# EAGLE design CurrentStabilizer (EAGLE 6.1)
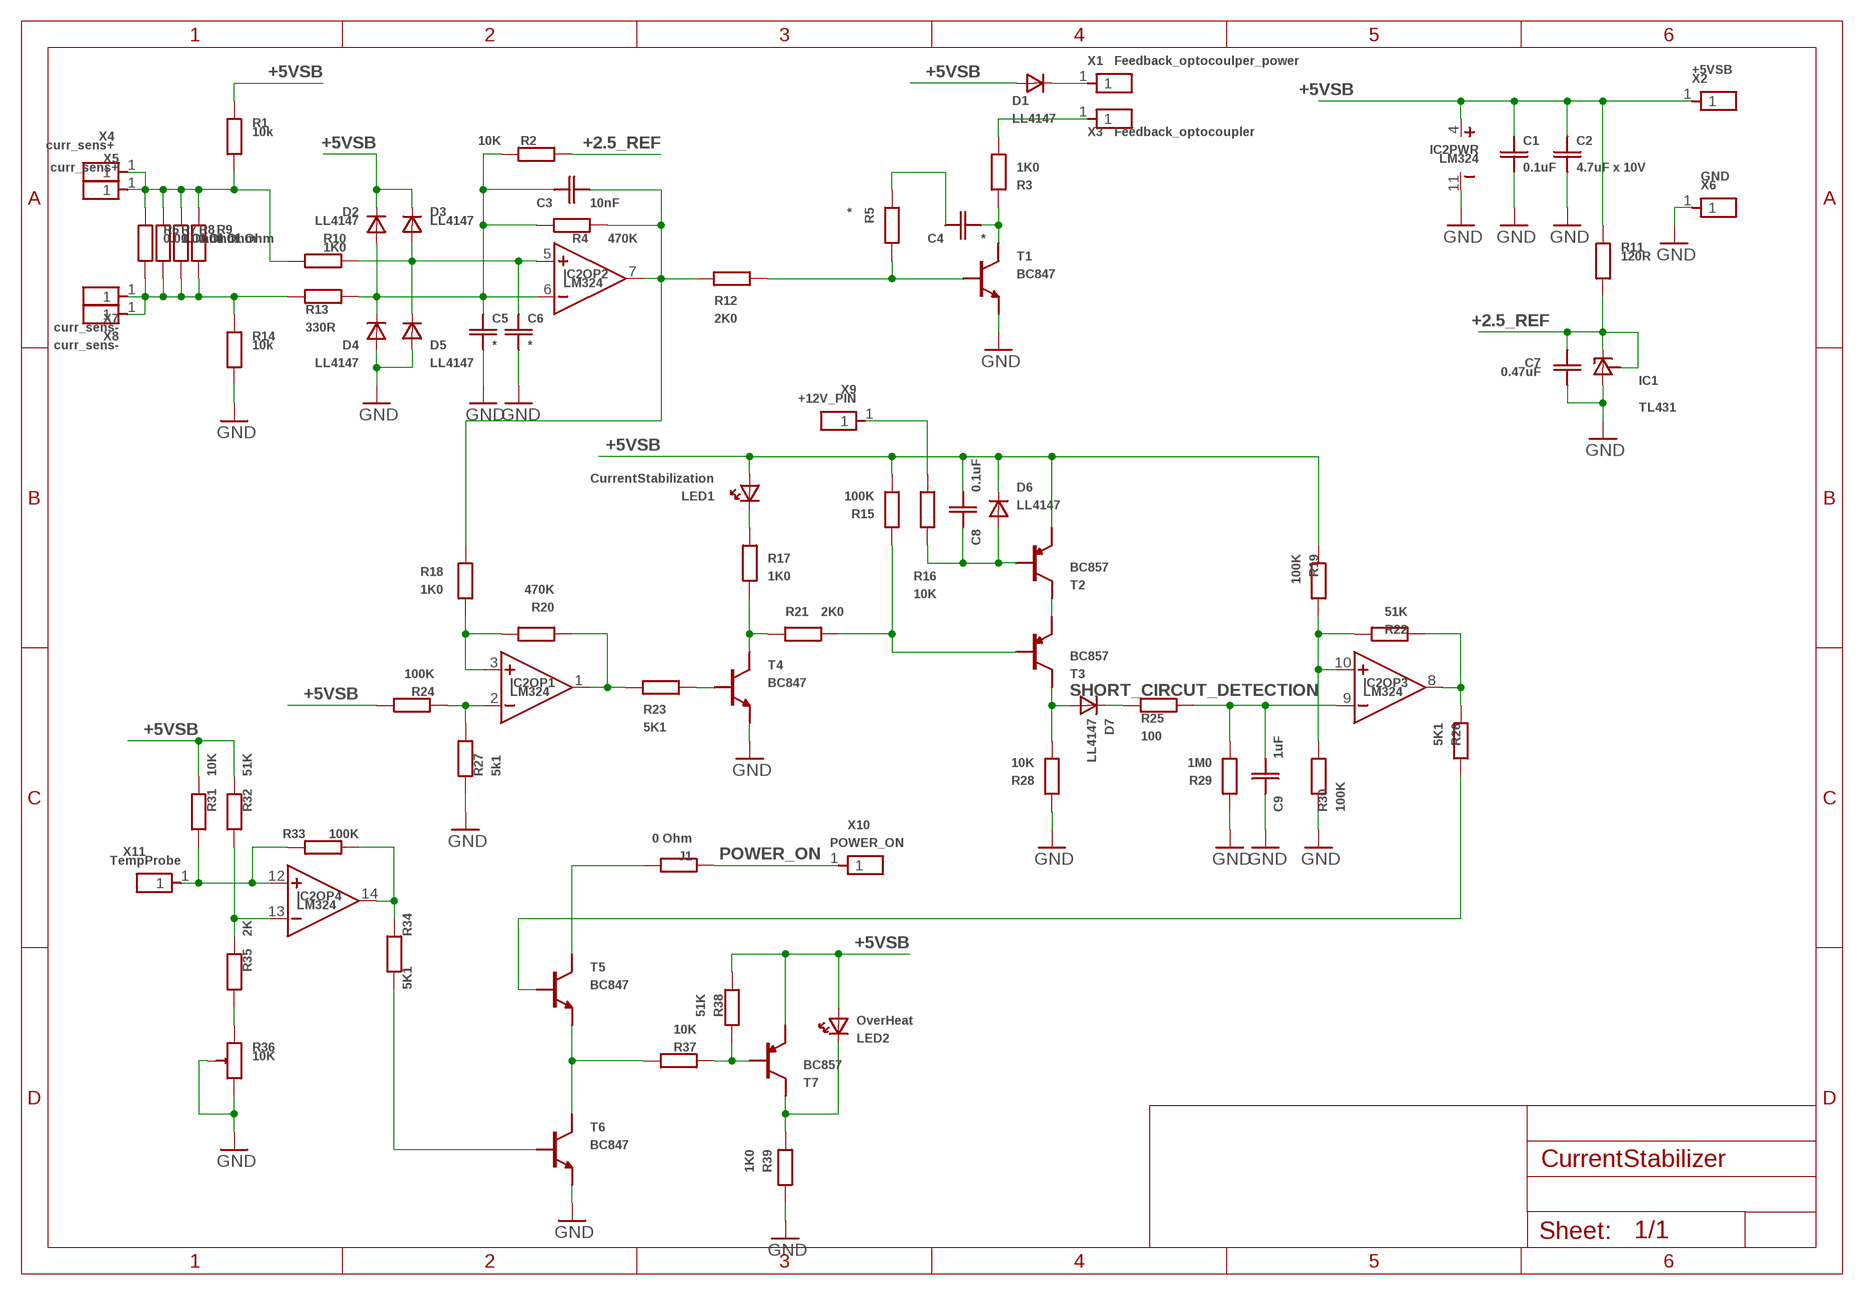
[diagram p0: schematic, sheet 1]

## Parts
C1  0.1uF  CSMD_1206_BIG_GAP  [RSMD_1206_BIG_GAP]
C2  4.7uF x 10V  CSMD_1206  [RSMD_1206]
C3  10nF  CSMD_0805  [RSMD_0805]
C4  *  CSMD_0805  [RSMD_0805]
C5  *  CSMD_0805  [RSMD_0805]
C6  *  CSMD_0805  [RSMD_0805]
C7  0.47uF  CSMD_0805  [RSMD_0805]
C8  0.1uF  CSMD_0805  [RSMD_0805]
C9  1uF  CSMD_0805  [RSMD_0805]
D1  LL4147  LL4147SOD-80  [SOD-80]
D2  LL4147  LL4147SOD-80  [SOD-80]
D3  LL4147  LL4147SOD-80  [SOD-80]
D4  LL4147  LL4147SOD-80  [SOD-80]
D5  LL4147  LL4147SOD-80  [SOD-80]
D6  LL4147  LL4147SOD-80  [SOD-80]
D7  LL4147  LL4147SOD-80  [SOD-80]
IC1  TL431  TL431SOT23  [SOT23]
IC2  LM324  [SOIC14]
J1  0 Ohm  RSMD_0805  [RSMD_0805]
LED1  CurrentStabilization  LED3MM  [LED3MM]
LED2  OverHeat  LED3MM  [LED3MM]
R1  10k  RSMD_0805  [RSMD_0805]
R2  10K  RSMD_0805  [RSMD_0805]
R3  1K0  RSMD_0805  [RSMD_0805]
R4  470K  RSMD_0805  [RSMD_0805]
R5  *  RSMD_0805  [RSMD_0805]
R6  0.01 Ohm  RSMD_2512  [RSMD_2512]
R7  0.01 Ohm  RSMD_2512  [RSMD_2512]
R8  0.01 Ohm  RSMD_2512  [RSMD_2512]
R9  0.01 Ohm  RSMD_2512  [RSMD_2512]
R10  1K0  RSMD_0805  [RSMD_0805]
R11  120R  RSMD_0805  [RSMD_0805]
R12  2K0  RSMD_0805  [RSMD_0805]
R13  330R  RSMD_0805  [RSMD_0805]
R14  10k  RSMD_0805  [RSMD_0805]
R15  100K  RSMD_0805  [RSMD_0805]
R16  10K  RSMD_0805  [RSMD_0805]
R17  1K0  RSMD_0805  [RSMD_0805]
R18  1K0  RSMD_0805  [RSMD_0805]
R19  100K  RSMD_0805  [RSMD_0805]
R20  470K  RSMD_0805  [RSMD_0805]
R21  2K0  RSMD_0805  [RSMD_0805]
R22  51K  RSMD_0805  [RSMD_0805]
R23  5K1  RSMD_0805  [RSMD_0805]
R24  100K  RSMD_0805  [RSMD_0805]
R25  100  RSMD_0805  [RSMD_0805]
R26  5K1  RSMD_0805  [RSMD_0805]
R27  5k1  RSMD_0805  [RSMD_0805]
R28  10K  RSMD_0805  [RSMD_0805]
R29  1M0  RSMD_0805  [RSMD_0805]
R30  100K  RSMD_0805  [RSMD_0805]
R31  10K  RSMD_0805  [RSMD_0805]
R32  51K  RSMD_0805  [RSMD_0805]
R33  100K  RSMD_0805  [RSMD_0805]
R34  5K1  RSMD_0805  [RSMD_0805]
R35  2K  RSMD_0805  [RSMD_0805]
R36  10K  R_ADJSTAND_6.5_X_3.5MM  [R_ADJ_STAND]
R37  10K  RSMD_0805  [RSMD_0805]
R38  51K  RSMD_0805  [RSMD_0805]
R39  1K0  RSMD_1206  [RSMD_1206]
T1  BC847  BC847SOT23_SMALL_PADS  [SOT23_SMALL_PADS]
T2  BC857  BC857SOT23_SMALL_PADS  [SOT23_SMALL_PADS]
T3  BC857  BC857SOT23_SMALL_PADS  [SOT23_SMALL_PADS]
T4  BC847  BC847SOT23_SMALL_PADS  [SOT23_SMALL_PADS]
T5  BC847  BC847SOT23_SMALL_PADS  [SOT23_SMALL_PADS]
T6  BC847  BC847SOT23_SMALL_PADS  [SOT23_SMALL_PADS]
T7  BC857  BC857SOT23_SMALL_PADS  [SOT23_SMALL_PADS]
X1  Feedback_optocoulper_power  PIN1X12.54MM  [PIN1X1_2.54MM]
X2  +5VSB  PIN1X12.54MM  [PIN1X1_2.54MM]
X3  Feedback_optocoupler  PIN1X12.54MM  [PIN1X1_2.54MM]
X4  curr_sens+  PIN1X12.54MM  [PIN1X1_2.54MM]
X5  curr_sens+  PIN1X12.54MM  [PIN1X1_2.54MM]
X6  GND  PIN1X12.54MM  [PIN1X1_2.54MM]
X7  curr_sens-  PIN1X12.54MM  [PIN1X1_2.54MM]
X8  curr_sens-  PIN1X12.54MM  [PIN1X1_2.54MM]
X9  +12V_PIN  PIN1X12.54MM  [PIN1X1_2.54MM]
X10  POWER_ON  PIN1X12.54MM  [PIN1X1_2.54MM]
X11  TempProbe  PIN1X12.54MM  [PIN1X1_2.54MM]

## Nets
+2.5_REF: C7.PAD_1(PIN1) IC1.1(CATHODE) IC1.2(REFERENCE) R2.PAD_0(PIN0) R11.PAD_0(PIN0)
+5VSB: C1.PAD_1(PIN1) C2.PAD_1(PIN1) C8.PAD_0(PIN0) D1.ANODE D2.CATHODE D3.CATHODE D6.CATHODE IC2.4(PWR:VCC) LED1.ANODE LED2.ANODE R1.PAD_1(PIN1) R11.PAD_1(PIN1) R15.PAD_0(PIN0) R19.PAD_0(PIN0) R24.PAD_1(PIN1) R31.PAD_1(PIN1) R32.PAD_1(PIN1) R38.PAD_0(PIN0) T2.2(E) T7.2(E) X2.1
GND: C1.PAD_0(PIN0) C2.PAD_0(PIN0) C5.PAD_0(PIN0) C6.PAD_0(PIN0) C7.PAD_0(PIN0) C9.PAD_1(PIN1) D4.ANODE D5.ANODE IC1.3(ANODE) IC2.11(PWR:GND) R14.PAD_0(PIN0) R27.PAD_0(PIN0) R28.PAD_1(PIN1) R29.PAD_1(PIN1) R30.PAD_0(PIN0) R36.2(ADJ) R36.3(END_B) R39.PAD_1(PIN1) T1.2(E) T4.2(E) T6.2(E) X6.1
N$1: R1.PAD_0(PIN0) R6.PAD1(PIN1) R7.PAD1(PIN1) R8.PAD1(PIN1) R9.PAD1(PIN1) R10.PAD_0(PIN0) X4.1 X5.1
N$2: R6.PAD0(PIN0) R7.PAD0(PIN0) R8.PAD0(PIN0) R9.PAD0(PIN0) R13.PAD_0(PIN0) R14.PAD_1(PIN1) X7.1 X8.1
N$3: C6.PAD_1(PIN1) D3.ANODE D5.CATHODE IC2.5(OP2:IN+) R10.PAD_1(PIN1)
N$4: C3.PAD_1(PIN1) C5.PAD_1(PIN1) D2.ANODE D4.CATHODE IC2.6(OP2:IN-) R2.PAD_1(PIN1) R4.PAD_0(PIN0) R13.PAD_1(PIN1)
N$5: IC2.3(OP1:IN+) R18.PAD_0(PIN0) R20.PAD_0(PIN0)
N$6: IC2.12(OP4:IN+) R31.PAD_0(PIN0) R33.PAD_1(PIN1) X11.1
N$7: C4.PAD_1(PIN1) R5.PAD_1(PIN1)
N$8: R23.PAD_0(PIN0) T4.1(B)
N$9: R3.PAD_1(PIN1) X3.1
N$10: C4.PAD_0(PIN0) R3.PAD_0(PIN0) T1.3(C)
N$11: IC2.1(OP1:OUT) R20.PAD_1(PIN1) R23.PAD_1(PIN1)
N$12: R17.PAD_1(PIN1) R21.PAD_0(PIN0) T4.3(C)
N$13: R37.PAD_0(PIN0) R38.PAD_1(PIN1) T7.1(B)
N$14: LED1.CATHODE R17.PAD_0(PIN0)
N$15: IC2.13(OP4:IN-) R32.PAD_0(PIN0) R35.PAD_1(PIN1)
N$16: IC2.14(OP4:OUT) R33.PAD_0(PIN0) R34.PAD_1(PIN1)
N$17: R34.PAD_0(PIN0) T6.1(B)
N$18: R5.PAD_0(PIN0) R12.PAD_0(PIN0) T1.1(B)
N$19: C8.PAD_1(PIN1) D6.ANODE R16.PAD_1(PIN1) T2.1(B)
N$20: R16.PAD_0(PIN0) X9.1
N$21: T2.3(C) T3.2(E)
N$22: R15.PAD_1(PIN1) R21.PAD_1(PIN1) T3.1(B)
N$23: D7.CATHODE R25.PAD_0(PIN0)
N$24: C9.PAD_0(PIN0) IC2.9(OP3:IN-) R25.PAD_1(PIN1) R29.PAD_0(PIN0)
N$25: IC2.10(OP3:IN+) R19.PAD_1(PIN1) R22.PAD_1(PIN1) R30.PAD_1(PIN1)
N$26: IC2.8(OP3:OUT) R22.PAD_0(PIN0) R26.PAD_0(PIN0)
N$27: R26.PAD_1(PIN1) T5.1(B)
N$28: R37.PAD_1(PIN1) T5.2(E) T6.3(C)
N$29: IC2.2(OP1:IN-) R24.PAD_0(PIN0) R27.PAD_1(PIN1)
N$30: C3.PAD_0(PIN0) IC2.7(OP2:OUT) R4.PAD_1(PIN1) R12.PAD_1(PIN1) R18.PAD_1(PIN1)
N$31: D1.CATHODE X1.1
N$32: R35.PAD_0(PIN0) R36.1(END_A)
N$33: J1.PAD_1(PIN1) T5.3(C)
N$34: LED2.CATHODE R39.PAD_0(PIN0) T7.3(C)
POWER_ON: J1.PAD_0(PIN0) X10.1
SHORT_CIRCUT_DETECTION: D7.ANODE R28.PAD_0(PIN0) T3.3(C)

## Library data of the parts
C1-C9 = __MyCommonLib1:C
D1-D7 = __MyCommonLib1:LL4147
IC1 = __MyCommonLib1:TL431
IC2 = __MyCommonLib1:LM324
J1 R1-R35 R37-R39 = __MyCommonLib1:R
LED1 LED2 = __MyCommonLib1:LED3MM
R36 = __MyCommonLib1:R_ADJ
T1 T4-T6 = __MyCommonLib1:BC847
T2 T3 T7 = __MyCommonLib1:BC857
X1-X11 = __MyCommonLib1:PIN1X1

## Board
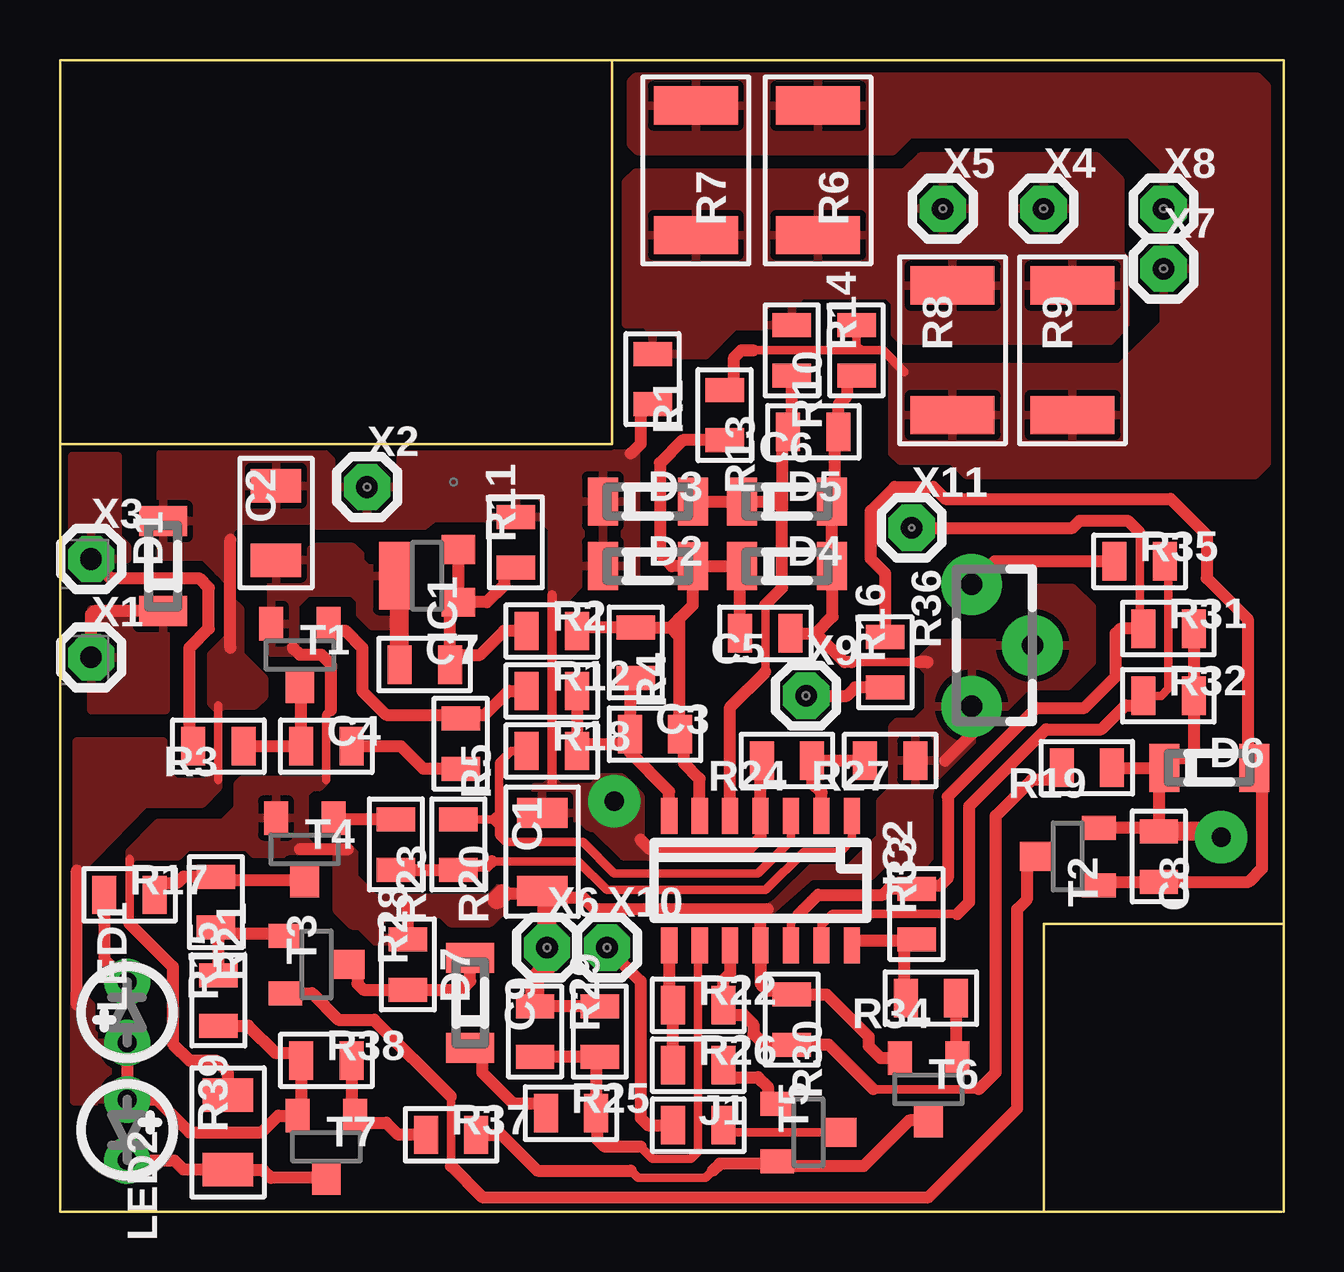
[diagram p1: board, top side]
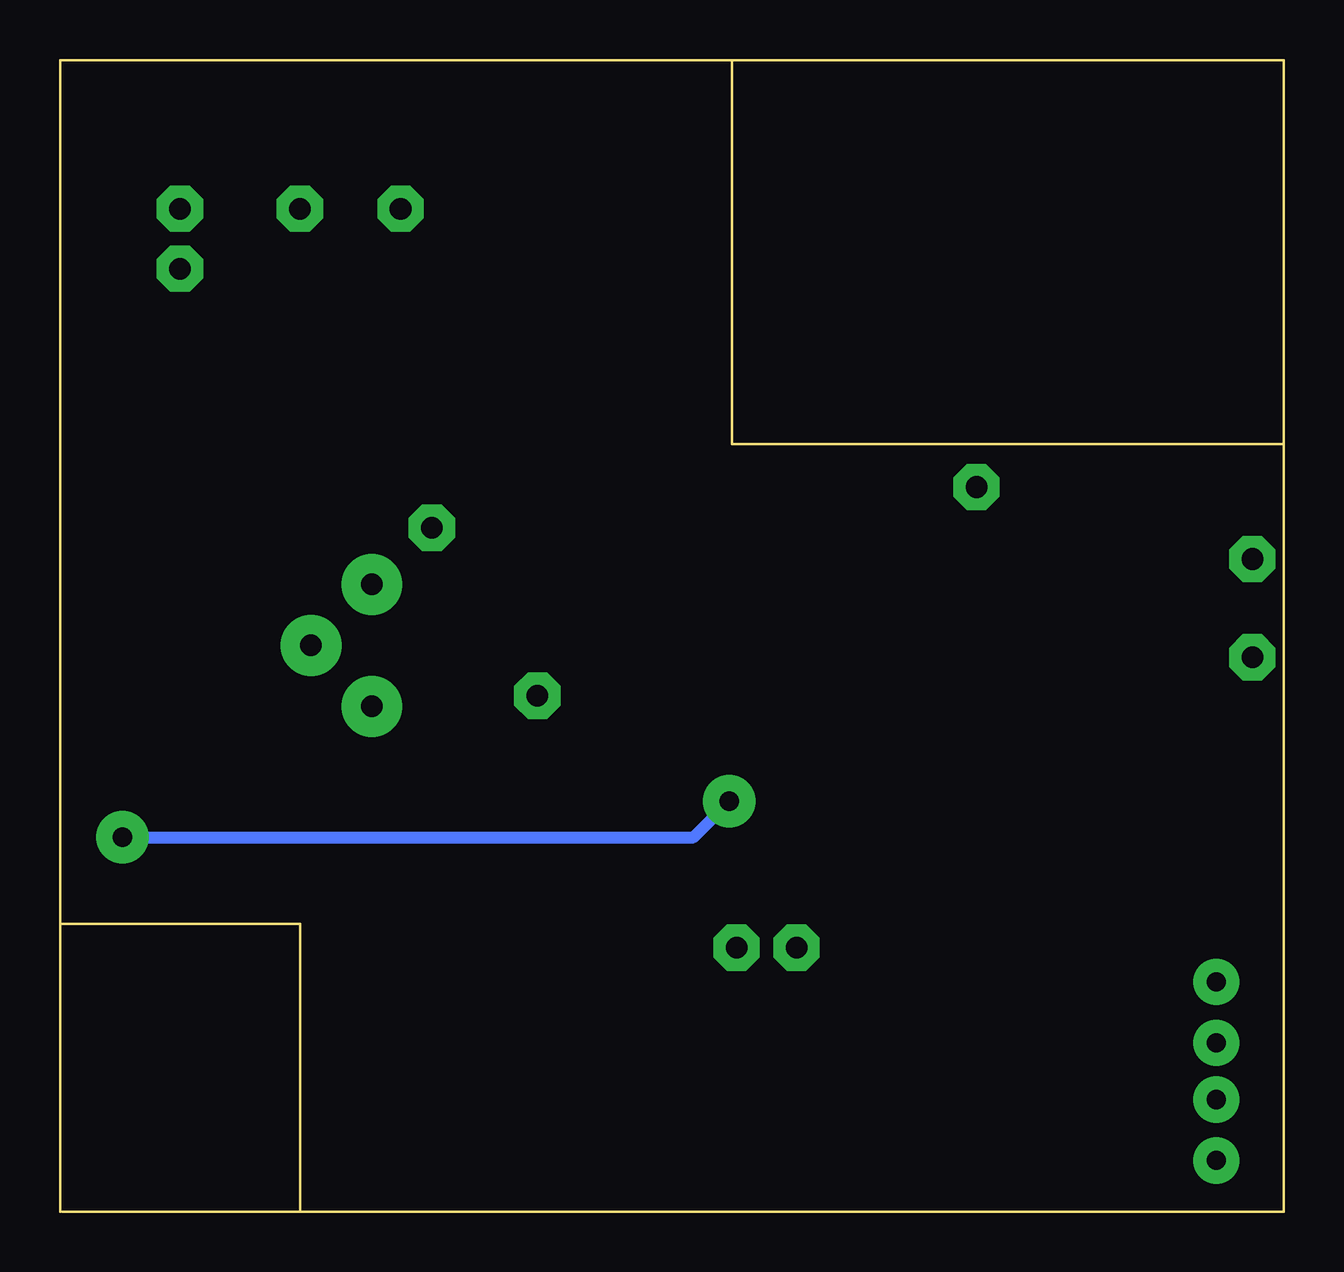
[diagram p2: board, bottom side, seen from below]

Size 51 x 48 mm. Coordinates in mm from the lower left corner, seen from the top.
Outline: 51,12 51,48 23,48
Outline: 41,0 0,0 0,32
Outline: 0,32 23,32 23,48
Outline: 41,0 41,12 51,12
Outline: 51,0 51,12
Outline: 41,0 50.9,0
Outline: 23,48 0,48 0,32
Copper layers (1*16): Top 0.035mm / dielectric 1.5mm / Bottom 0.035mm
Design rules: minimum track width 0.35mm, minimum drill 0.6mm, track to track 0.35mm, track to pad 0.35mm, pad to pad 0.35mm, via to via 0.35mm, smd to smd 0mil, copper to edge 0.2mm, drill to drill 1mm, minimum pad ring 0.35mm, minimum via ring 0.35mm, stop-mask expansion 0mil, vias tented up to drill 0mil, thermal gap 10mil

### Footprints (pad centres in the part's own frame; a part is rotated, then mirrored left to right if it is on the bottom)
RSMD_1206_BIG_GAP = smd 1.25 x 2.1: PAD_0 -1.625,0; PAD_1 1.625,0
RSMD_1206 = smd 1.4 x 2.1: PAD_0 -1.55,0; PAD_1 1.55,0
RSMD_0805 = smd 1 x 1.6: PAD_0 -1.05,0; PAD_1 1.05,0
SOD-80 = smd 1.25 x 2: ANODE 1.875,0; CATHODE -1.875,0
SOT23 = smd 1.2 x 1.4: 1 1.1,1.3; 2 -1.1,1.3 | smd 2.8 x 1.4: 3 0,-1.3
SOIC14 = smd 1.5 x 0.68: 1 -2.699,3.81; 2 -2.699,2.54; 3 -2.699,1.27; 4 -2.699,0; 5 -2.699,-1.27; 6 -2.699,-2.54; 7 -2.699,-3.81; 8 2.699,-3.81; 9 2.699,-2.54; 10 2.699,-1.27; 11 2.699,0; 12 2.699,1.27; 13 2.699,2.54; 14 2.699,3.81
LED3MM = drill 0.8 pad 1.93: ANODE -1.27,0; CATHODE 1.27,0
RSMD_2512 = smd 1.6 x 3.5: PAD0 -2.7,0; PAD1 2.7,0
R_ADJ_STAND = drill 0.9 pad 2.54: 1 -2.54,0; 2 0,2.54; 3 2.54,0
SOT23_SMALL_PADS = smd 1 x 1.4: 1 1.2,1.3; 2 -1.2,1.3 | smd 1.2 x 1.4: 3 0,-1.3
PIN1X1_2.54MM = drill 0.9 pad 1.93 octagon: 1 0,0

### Placement (x,y rotation side)
C1  20.1,15 90 top
C2  9,28.7 90 top
C3  24.8,19.9 0 top
C4  11.1,19.4 0 top
C5  29.4,24.1 180 top
C6  31.4,32.5 180 top
C7  15.2,22.8 0 top
C8  45.8,14.8 270 top
C9  19.8,7.5 90 top
D1  4.3,26.9 90 top
D2  24.5,26.9 0 top
D3  24.5,29.6 0 top
D4  30.3,26.9 0 top
D5  30.3,29.6 0 top
D6  47.9,18.5 0 top
D7  17.1,8.7 90 top
IC1  15.3,26.5 270 top
IC2  29.2,13.8 270 top
J1  26.6,3.6 0 top
LED1  2.8,8.3 90 top
LED2  2.8,3.4 270 top
R1  24.7,34.7 270 top
R2  20.5,24.2 0 top
R3  6.6,19.4 180 top
R4  24,23.3 270 top
R5  16.7,19.5 270 top
R6  31.6,43.4 270 top
R7  26.5,43.4 270 top
R8  37.2,35.9 90 top
R9  42.2,35.9 90 top
R10  30.5,35.9 270 top
R11  19,27.9 90 top
R12  20.5,21.7 0 top
R13  27.7,33.2 270 top
R14  33.2,35.9 90 top
R15  6.6,8.8 90 top
R16  34.4,22.9 90 top
R17  2.9,13.2 0 top
R18  20.5,19.2 0 top
R19  42.8,18.5 180 top
R20  16.6,15.3 270 top
R21  6.5,12.9 270 top
R22  26.6,8.6 0 top
R23  14,15.3 270 top
R24  30.3,18.8 180 top
R25  21.3,4.1 0 top
R26  26.6,6.1 0 top
R27  34.6,18.8 180 top
R28  14.5,10.3 90 top
R29  22.5,7.5 90 top
R30  30.5,8 270 top
R31  46.2,24.3 0 top
R32  46.2,21.5 0 top
R33  35.7,12.4 90 top
R34  36.3,8.9 180 top
R35  45,27.1 0 top
R36  38,23.6 270 top
R37  16.3,3.2 0 top
R38  11.1,6.3 0 top
R39  7,3.3 90 top
T1  10,23.2 0 top
T2  42,14.8 270 top
T3  10.7,10.3 90 top
T4  10.2,15.1 0 top
T5  31.2,3.3 90 top
T6  36.2,5.1 0 top
T7  11.1,2.7 0 top
X1  1.3,23.1 0 top
X2  12.8,30.2 0 top
X3  1.3,27.2 0 top
X4  41,41.8 0 top
X5  36.8,41.8 0 top
X6  20.3,11 0 top
X7  46,39.3 0 top
X8  46,41.8 0 top
X9  31.1,21.5 0 top
X10  22.8,11 0 top
X11  35.5,28.5 0 top

### Tracks (layer width: path | path; a pad name or v marks a point on that pad's centre or on a via)
+2.5_REF
  Top 0.5: IC1.2 IC1.1 | IC1.1 16.25,25.05 C7.PAD_1 16.65,23.2 17.5,23.2 18.5,24.2 R2.PAD_0 | R11.PAD_0 18.5,26.85 18.5,26.1 17.8,25.4 IC1.1
+5VSB  (via drill 0.8 pad 2.18)
  Top 0.35: 6.6,18 6.6,21.1
  Top 0.4: 20.5,17.8 20.5,25.7
  Top 0.5: LED1.ANODE LED2.ANODE 4.03,4.67 5.4,3.3 8.4,3.3 9.1,4 T7.2 10.05,4.15 R38.PAD_0 9.75,6.6 9,6.6 7.85,7.75 R15.PAD_0 | 0.7,8.63 0.7,14.2 | 7.1,23.5 7.1,28 | R19.PAD_0 D6.CATHODE | R31.PAD_1 R32.PAD_1 47.25,19.15 47,18.9 46.02,18.9 D6.CATHODE | 24.2,15.5 24.6,15.1 28.7,15.1 29.2,15.6 IC2.4 29.2,18.75 R24.PAD_1 | D6.CATHODE 45.8,18.27 C8.PAD_0 45.65,16 T2.2 | R1.PAD_1 24.2,33.65 24.2,32 23.8,31.6
  Top 0.8: v48.4,15.6 48.15,15.85 C8.PAD_0
  Bottom 0.5: v48.4,15.6 24.6,15.6 v23.1,17.1
  pour Top: 4.2,31.6 4.2,27.3 6,27.3 7.1,26.2 7.1,28.4 7.5,28.8 10.5,28.8 10.7,28.6 15.2,28.6 15.6,28.9 20.1,28.9 20.5,28.5 20.5,25.5 21,25.5 21.8,26.3 24,26.3 24,31.6 14.4,31.6 14.2,31.4 14.2,30.4 14,30.2 11.4,30.2 11.3,30.3 11.3,31.3 11,31.6
  pour Top: 19.8,16.4 21.7,16.4 22.1,16 22.3,16 23.5,14.8 28.5,14.8 28.7,15 28.7,15.2 24.6,15.2 24.2,15.6 24.2,17.3 23.4,18.1 22.6,18.1 22.2,17.7 20.8,17.7 20.5,18 20.2,17.7 19.8,17.7
  pour Top: 6.6,20.9 6.3,21.2 6.3,22.9 6.3,23.2 7.1,24 7.1,25.5 7.5,25.1 7.5,23.2 8,22.7 8.5,22.2 8.5,21.5 8.1,21.1 7.2,21.1 6.8,21.1
  pour Top: 0.7,14.1 3.5,17 5.9,17 6.6,17.7 6.6,18.4 6.1,17.9 4.8,17.9 4.3,18.4 4.3,19.6 0.7,19.6
  pour Top: 2.8,4.6 0.6,4.6 0.6,9.1 0.8,9.1 1.3,8.6 1.3,7.5 1.6,7.2 2.9,7.2
GND
  Top 0.35: 2.9,12 2.9,14.7 | 35.8,22.9 33,22.9 | 11.3,20.9 11.1,20.7 11.1,18
  Top 0.5: 12,15.1 10,15.1 | 2.9,12 4.7,10.2 4.7,7 5.4,6.3 6.5,6.3 7,5.8 R39.PAD_1 | 37.96,21.1 R36.3 38,19.9 36.9,18.8 | C5.PAD_0 31.5,24.1 | 31.5,24.1 32.2,24.8 32.2,26.88 D4.ANODE D5.ANODE 32.3,29.73 32.3,32.35 C6.PAD_0 32.45,33.65 32.8,34 32.8,34.45 R14.PAD_0 | 36.16,22.9 35.8,22.9 | 33,22.9 32.7,22.9 31.5,24.1 | R27.PAD_0 35.6,18.75 | T6.2 34.2,6.4 33.7,6.9 33.7,7.3 31.95,9.05 R30.PAD_0 30.35,9.2 29.5,9.2 29.2,9.5 IC2.11 29.2,12.3 29.5,12.6 22.3,12.6 21.8,13.1 20.38,13.1 C1.PAD_0 19.98,13.25 18.45,13.25 | R29.PAD_1 C9.PAD_1 | R28.PAD_1 14.5,12.7 | 11.3,20.9 11.3,22.8 10.9,23.2 10,23.2 9.7,23.5
  Top 0.8: C7.PAD_0 14.15,26.35 IC1.3 | C9.PAD_1 19.8,9.7 20.3,10.2 X6.1 20.3,13.38 C1.PAD_0 | 18.45,13.25 18.2,13
  pour Top: 29.1,12.1 29.2,12.1 29.6,12.5 31.3,14 33.8,14 34.3,14.5 36,14.5 36.3,14.8 36.3,17.9 40.3,21.9 42,21.9 43,22.9 43,25.2 42.2,26 40.5,26 40.5,23.7 36.6,23.7 35.8,22.9 36.2,22.5 36.2,20.9 35.7,20.4 34.9,20.4 34.7,20.2 34.7,17.6 34.2,17.1 34.2,15.6 32.9,14.3 31.2,14.3 29.5,12.6 28.6,12.6
  pour Top: 11.6,15.1 11.6,12.6 12.2,12 12.5,12 13.2,11.3 14.4,11.3 14.4,12 14.9,12.5 15.9,12.5 16.3,12.1 17.9,12.1 18.4,12.6 18.4,13.5 17.9,13 13.1,13 12.2,13.9 12.2,14.9 12,15.1
  pour Top: 2.9,14.6 3.1,14.8 4.9,14.8 5.3,15.2 7.8,15.2 8.1,14.9 10.5,14.9 10.6,15.1 10.2,15.5 10.2,17.4 10.5,17.7 10.8,17.7 11.1,18 7.6,18 7.4,17.8 7.4,16.8 6.8,16.2 4.1,16.2 2.9,15
  pour Top: 8.8,23.3 9.8,23.3 9.8,25.3 10.3,25.8 12.2,25.8 12.5,25.5 12.5,24.9 13,24.4 14.2,24.4 14.2,26.8 12.8,26.8 12.5,27.1 12.5,27.4 12.2,27.7 10.6,27.7 10.1,27.2 8.8,27.2
N$1
  pour Top: 23.6,37 24.4,37 24.6,36.8 24.6,35.9 24.8,35.7 26.9,35.7 28.1,36.9 30.5,36.9 30.5,37.8 30.9,38.2 34.5,38.2 34.8,37.9 34.8,36.6 35.1,36.3 43.8,36.3 44.4,37 44.4,39.7 44.2,39.9 44.2,43 43.2,44 35.9,44 35.2,43.3 24,43.3 23.6,42.9
N$2
  Top 0.35: 28.9,35.9 33,35.9 | 33,35.9 33.2,36.1 | R14.PAD_1 33.2,36.1 | 33.2,36.1 33.4,35.9 | 33.4,35.9 33,35.9 | 33.4,35.9 34.3,35.9 35.2,35
  Top 0.5: R13.PAD_0 28.1,34.25 28.1,35.6 28.4,35.9 28.9,35.9
  pour Top: 44.2,35.2 35,35.2 34.7,35.5 34.7,31.6 35,31.3 37.2,31.3 37.8,30.7 49.8,30.7 50.3,31.2 50.3,46.9 49.9,47.3 24,47.3 23.8,47.1 23.8,44.5 24.1,44.2 34.7,44.2 35.4,44.9 44.6,44.9 46,43.5 46,37
N$3
  Top 0.35: 29.4,22.5 29.4,25.3
  Top 0.5: 29.4,25.3 30.1,26 30.1,29.3 | D3.ANODE D5.CATHODE 29.8,29.6 | IC2.5 27.93,21.03 29.4,22.5 | 30.1,29.3 29.8,29.6 | 29.8,29.6 30.1,29.9 | 30.1,29.9 30.1,29.3 | 30.1,29.9 30.1,32.25 C6.PAD_1 30.5,32.65 R10.PAD_1
N$4
  Top 0.5: D2.ANODE D4.CATHODE 28.35,26.82 C5.PAD_1 | D2.ANODE 26.38,25.27 25.8,24.7 | D2.ANODE 25.5,26.9 25,27.4 25,31.2 25.95,32.15 R13.PAD_1 | IC2.6 26.66,18.04 26,18.7 26,19.75 C3.PAD_1 25.8,19.95 25.8,24 | R2.PAD_1 21.55,24.35 R4.PAD_0 25.45,24.35 25.8,24.7 | 25.8,24 25.5,24.3 | 25.8,24.7 25.8,24
N$5
  Top 0.35: IC2.3 30.47,15.47 29.1,14.1 23.1,14.1 21.8,15.4 18.6,15.4 18.3,15.7 18.3,16.1 | 18.3,16.1 18.3,16.6 | R20.PAD_0 18.05,16.35 18.3,16.1 | 18.3,16.6 18.1,16.4 | R18.PAD_0 18.8,19.2 18.3,18.7 18.3,16.6
N$6
  Top 0.35: 45,28.3 45,24.5 | IC2.12 30.47,12.07 30.8,12.4
  Top 0.5: X11.1 42.2,28.5 42.5,28.8 44.5,28.8 45,28.3 | 45,24.5 45,24.45 R31.PAD_0 44.2,24.3 44,24.1 44,22.3 42.7,21 40.7,21 37,17.3 37,13.9 36.7,13.6 35.85,13.6 R33.PAD_1 34.55,13.45 34.3,13.2 31.6,13.2 30.8,12.4
N$7
  Top 0.5: C4.PAD_1 14.2,19.4 15.15,18.45 R5.PAD_1
N$8
  Top 0.5: R23.PAD_0 11.45,16.35 T4.1
N$9
  Top 0.5: X3.1 2.1,26.4 5.8,26.4 6.2,26 6.2,24.3 5.4,23.5 5.4,19.55 R3.PAD_1
  pour Top: 1.4,27.2 2.8,27.2 2.8,27.7 2.4,28.1 2.4,31.5 0.5,31.5 0.5,27.2
N$10
  Top 0.5: T1.3 10.05,21.85 C4.PAD_0 R3.PAD_0
N$11
  Top 0.35: IC2.1 33.01,15.51 32.5,15 31,15 29.4,13.4 22.8,13.4 21.6,14.6 18,14.6
  Top 0.5: R23.PAD_1 R20.PAD_1 16.7,14.35 16.7,14.4 17.8,14.4 18,14.6
N$12
  Top 0.5: T4.3 6.65,13.8 R21.PAD_0 5.15,13.95 4.9,13.7 3.95,13.7 R17.PAD_1
N$13
  Top 0.5: R38.PAD_1 12.15,4.15 T7.1 12.3,3.7 13.6,3.7 14.1,3.2 R37.PAD_0
N$14
  Top 0.5: R17.PAD_0 1.85,10.52 LED1.CATHODE
N$15
  Top 0.35: 37.4,12.4 32.2,12.4 31.74,11.94 IC2.13 | R35.PAD_1 46.2,26.95 46.2,21.8 45.9,21.5 R32.PAD_0
  Top 0.5: 37.4,12.4 37.9,12.9 37.9,16.9 41.1,20.1 43.4,20.1 44.4,21.1 45.1,21.1 45.1,21.45 R32.PAD_0
N$16
  Top 0.5: IC2.14 33.21,11.3 35.2,11.3 | 35.2,11.3 35.65,11.3 R33.PAD_0 | R34.PAD_1 35.2,8.95 35.2,11.3
N$17
  Top 0.5: R34.PAD_0 37.35,6.45 T6.1
N$18
  Top 0.5: R12.PAD_0 18.7,21.7 17.7,20.7 16.85,20.7 R5.PAD_0 16.6,20.65 16.6,20.7 13.6,20.7 12.6,21.7 12.6,23.5 11.9,24.2 11.5,24.2 T1.1
N$19
  Top 0.5: R16.PAD_1 34.4,26.6 33.8,27.2 33.8,29.2 34.8,30.2 36.4,30.2 36.9,29.7 46.3,29.7 47.8,28.2 47.8,26.4 49.5,24.7 49.5,18.8 49.8,18.5 D6.ANODE 50.1,18.18 50.1,14.3 49.55,13.75 C8.PAD_1 43.45,13.75 T2.1
N$20
  Top 0.5: X9.1 32.8,21.5 33.15,21.85 R16.PAD_0
N$21
  Top 0.35: 16.3,4.8 16.3,1.9
  Top 0.5: 16.3,4.8 13.1,8 11.6,8 10.5,9.1 T3.2 | 16.3,1.9 17.6,0.6 36.2,0.6 39.9,4.3 39.9,12.6 40.3,13 40.3,14.4 T2.3
N$22
  Top 0.5: R21.PAD_1 6.6,11.75 | 6.6,11.75 R15.PAD_1 | 6.6,11.75 6.75,11.6 9.3,11.6 T3.1
N$23
  Top 0.5: D7.CATHODE 17.6,6.33 17.6,5.8 18.9,4.5 19.85,4.5 R25.PAD_0
N$24
  Top 0.35: IC2.9 26.6,11.04 26.6,2.5 26.3,2.2 24.7,2.2 24.2,2.7
  Top 0.5: C9.PAD_0 R29.PAD_0 22.35,6.3 R25.PAD_1 22.4,4.1 | 24.2,2.7 22.7,2.7 22.4,3 22.4,4.1 | 22.4,4.1 22.3,4.2
N$25
  Top 0.35: 38.3,5.1 33.9,5.1
  Top 0.5: 38.3,5.1 39,5.8 39,16.5 40.5,18 41.5,18 41.5,18.25 arc-90 R19.PAD_1 | IC2.10 27.93,9.93 27.65,9.65 R22.PAD_1 28.05,8.2 28.5,8.2 28.9,7.8 28.9,7.4 29.35,6.95 R30.PAD_1 32.05,6.95 33.9,5.1
N$26
  Top 0.5: IC2.8 25.39,9.31 25.55,9.15 R22.PAD_0 R26.PAD_0
N$27
  Top 0.5: R26.PAD_1 27.7,6.05 27.7,5.7 27.8,5.6 29.1,5.6 29.5,5.2 29.5,4.9 arc90 T5.1
N$28
  Top 0.35: 23.8,1.7 24.1,1.4 26.9,1.4 27.2,1.7
  Top 0.5: R37.PAD_1 18.4,3.2 19.9,1.7 23.8,1.7 | 27.2,1.7 27.5,2 29.8,2 T5.2 30.1,1.9 33.5,1.9 35.4,3.8 T6.3
N$29
  Top 0.5: IC2.2 31.74,17.46 31.35,17.85 R24.PAD_0 R27.PAD_1
N$30
  Top 0.5: R12.PAD_1 R18.PAD_1 21.85,19.5 23.8,19.5 23.8,19.2 23.75,19.15 | R4.PAD_1 23.75,22 C3.PAD_0 23.75,19.15 | IC2.7 25.39,17.51 23.75,19.15
N$31
  Top 0.5: X1.1 1.3,24.9 1.42,25.02 D1.CATHODE
  pour Top: 1.3,25.1 1.3,20.9 4.4,20.9 4.4,25.1
N$32
  Top 0.5: R35.PAD_0 38.96,27.1 R36.1
N$33
  Top 0.35: T5.3 28,3.3 27.7,3.6 J1.PAD_1
N$34
  Top 0.5: LED2.CATHODE 4.77,2.13 5.15,1.75 R39.PAD_0 8.45,1.75 8.8,1.4 T7.3
POWER_ON
  Top 0.5: X10.1 24.2,9.6 24.2,3.9 24.5,3.6 J1.PAD_0
SHORT_CIRCUT_DETECTION
  Top 0.5: T3.3 12.4,9.9 12.4,9.5 12.65,9.25 R28.PAD_0 16.75,9.25 17.1,9.6 D7.ANODE

### Text on the board
tDocu: CS+ | CS- | +5V | GND | Feedback | Rt_sensor | OC_pwr | +12V | POWER_OK | GND